# Altium schematic sheet BMS_MASTER.SchDoc
size A4; SheetNumber: 1; SheetTotal: 7
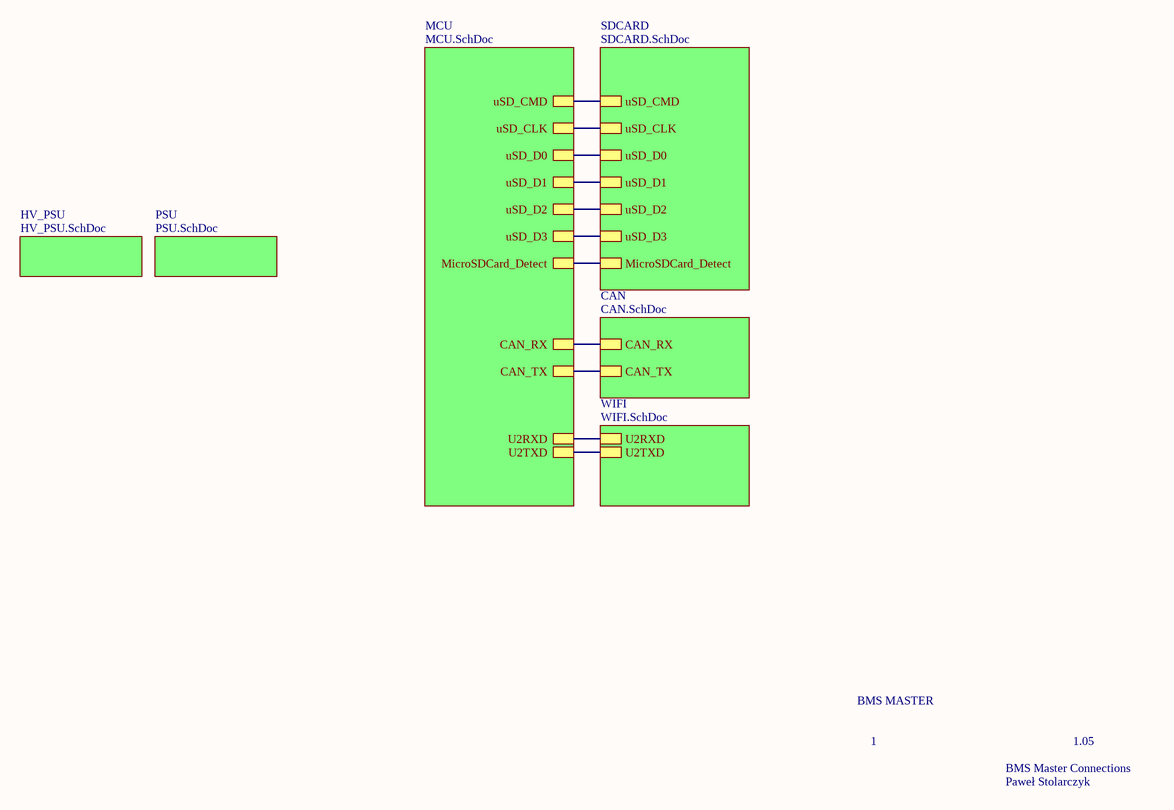
[diagram p0: BMS_MASTER.SchDoc]

## Sub-sheets
CAN = CAN.SchDoc: CAN_RX, CAN_TX
HV_PSU = HV_PSU.SchDoc: no entries
MCU = MCU.SchDoc: uSD_CMD, uSD_CLK, uSD_D0, uSD_D1, uSD_D2, uSD_D3, MicroSDCard_Detect, CAN_RX, CAN_TX, U2RXD, U2TXD
PSU = PSU.SchDoc: no entries
SDCARD = SDCARD.SchDoc: uSD_CMD, uSD_CLK, uSD_D0, uSD_D1, uSD_D2, uSD_D3, MicroSDCard_Detect
WIFI = WIFI.SchDoc: U2RXD, U2TXD

## Nets
(unnamed): sheet MCU/uSD_CMD, sheet SDCARD/uSD_CMD
(unnamed): sheet MCU/uSD_CLK, sheet SDCARD/uSD_CLK
(unnamed): sheet MCU/uSD_D0, sheet SDCARD/uSD_D0
(unnamed): sheet MCU/uSD_D1, sheet SDCARD/uSD_D1
(unnamed): sheet MCU/uSD_D2, sheet SDCARD/uSD_D2
(unnamed): sheet MCU/uSD_D3, sheet SDCARD/uSD_D3
(unnamed): sheet MCU/MicroSDCard_Detect, sheet SDCARD/MicroSDCard_Detect
(unnamed): sheet MCU/CAN_RX, sheet CAN/CAN_RX
(unnamed): sheet MCU/CAN_TX, sheet CAN/CAN_TX
(unnamed): sheet MCU/U2RXD, sheet WIFI/U2RXD
(unnamed): sheet MCU/U2TXD, sheet WIFI/U2TXD

## Notes on the sheet
- BMS MASTER
- 1
- BMS Master Connections
- 1.05
- Paweł Stolarczyk